# Altium project PowerLatch.PrjPcb
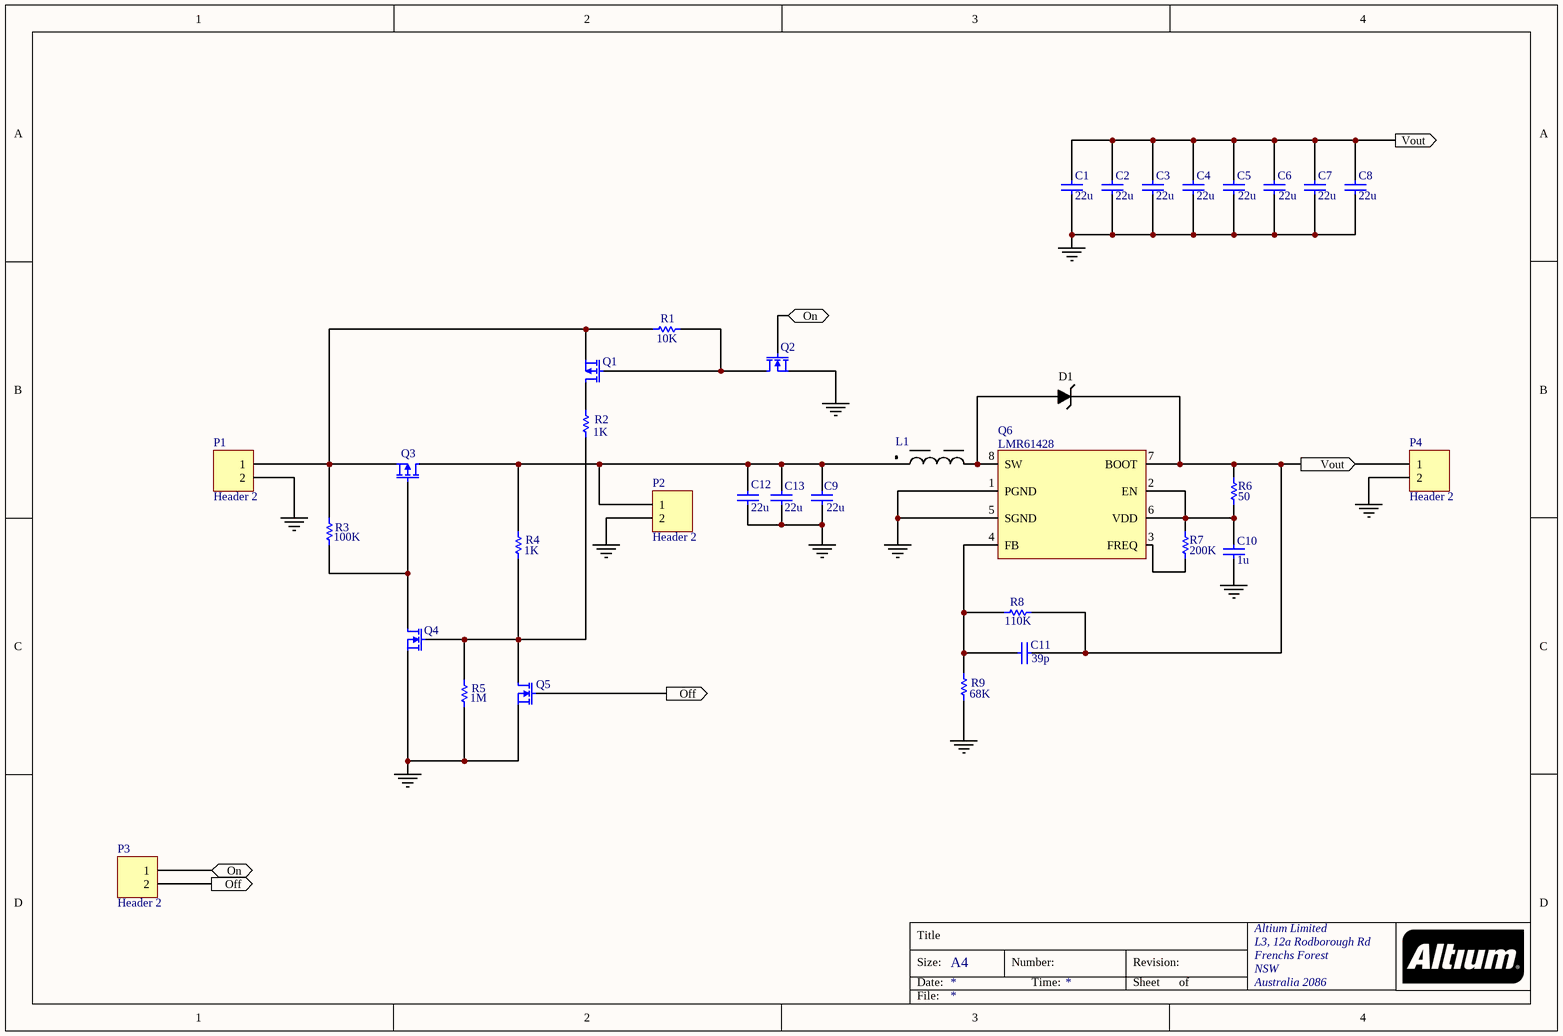
[diagram p0: PowerLatch.SchDoc]
1 sheet, 34 parts. Net scope: flat (ports and power ports of the same name join across sheets).
Board file: PowerLatch.PcbDoc

## Sheet PowerLatch.SchDoc
size A4; Organization: Altium Limited; Address1: L3, 12a Rodborough Rd; Address2: Frenchs Forest; Address3: NSW; Address4: Australia 2086

### Parts
C1  value 22u  [CAPC3225X28N]  (hidden comment: Cap)
C2  value 22u  [CAPC3225X28N]  (hidden comment: Cap)
C3  value 22u  [CAPC3225X28N]  (hidden comment: Cap)
C4  value 22u  [CAPC3225X28N]  (hidden comment: Cap)
C5  value 22u  [CAPC3225X28N]  (hidden comment: Cap)
C6  value 22u  [CAPC3225X28N]  (hidden comment: Cap)
C7  value 22u  [CAPC3225X28N]  (hidden comment: Cap)
C8  value 22u  [CAPC3225X28N]  (hidden comment: Cap)
C9  value 22u  [C1210_M]  (hidden comment: Cap)
C10  value 1u  [C1210_M]  (hidden comment: Cap)
C11  value 39p  [C1210_M]  (hidden comment: Cap)
C12  value 22u  [C1210_M]  (hidden comment: Cap)
C13  value 22u  [C1210_M]  (hidden comment: Cap)
D1  Schottky  [DIOM4336X25N]  (value not drawn)
L1  Inductor  [INDP120120X100N]  (value not drawn)
P1  Header 2  [HDR1X2]
P2  Header 2  [HDR1X2]
P3  Header 2  [HDR1X2]
P4  Header 2  [HDR1X2]
Q1  MOSFET P-Channel  [SOT95P245X110-3N]  (value not drawn)
Q2  MOSFET N-Channel  [SOT95P245X110-3N]  (value not drawn)
Q3  MOSFET P-Channel  [SOT95P245X110-3N]  (value not drawn)
Q4  MOSFET N-Channel  [SOT95P245X110-3N]  (value not drawn)
Q5  MOSFET N-Channel  [SOT95P245X110-3N]  (value not drawn)
Q6  LMR61428  [TSOP65P490X110-8N]
R1  value 10K  [RESC1608X06N]  (hidden comment: Res1)
R2  value 1K  [RESC1608X06N]  (hidden comment: Res1)
R3  value 100K  [RESC1608X06N]  (hidden comment: Res1)
R4  value 1K  [RESC1608X06N]  (hidden comment: Res1)
R5  value 1M  [RESC1608X06N]  (hidden comment: Res1)
R6  value 50  [RESC1608X06N]  (hidden comment: Res1)
R7  value 200K  [RESC1608X06N]  (hidden comment: Res1)
R8  value 110K  [RESC1608X06N]  (hidden comment: Res1)
R9  value 68K  [RESC1608X06N]  (hidden comment: Res1)

### Ports
Off (out), On (bidir), Vout (out)

### Nets
GND: C1.1 C2.1 C3.1 C4.1 C5.1 C6.1 C7.1 C8.1 C9.2 C10.1 C12.2 C13.2 P1.2 P2.2 P4.2 Q2.2(S) Q4.2(S) Q5.2(S) Q6.1(PGND) Q6.5(SGND) R5.1 R9.2
NetC1_2: C1.2 C2.2 C3.2 C4.2 C5.2 C6.2 C7.2 C8.2 C11.1 D1.2(K) P4.1 Q6.7(BOOT) R6.1 R8.2 ; port Vout
NetC9_1: C9.1 C12.1 C13.1 L1.1 P2.1 Q3.3(D) R4.2
NetC10_2: C10.2 Q6.2(EN) Q6.6(VDD) R6.2 R7.1
NetC11_2: C11.2 Q6.4(FB) R8.1 R9.1
NetD1_1: D1.1(A) L1.2 Q6.8(SW)
NetP1_1: P1.1 Q1.2(S) Q3.2(S) R1.2 R3.2
NetP3_1: P3.1 Q2.1(G) ; port On
NetP3_2: P3.2 Q5.1(G) ; port Off
NetQ1_1: Q1.1(G) Q2.3(D) R1.1
NetQ1_3: Q1.3(D) R2.2
NetQ3_1: Q3.1(G) Q4.3(D) R3.1
NetQ4_1: Q4.1(G) Q5.3(D) R2.1 R4.1 R5.2
NetQ6_3: Q6.3(FREQ) R7.2

### Notes on the sheet
- Title
- Size:
- Date:
- A4
- Number:
- Time:
- Revision:
- Sheet
- of
- File:

### Library data of the parts
C1-C13 = Cap: Capacitor; Published: 8-Jun-2000; LatestRevisionDate: 17-Jul-2002; LatestRevisionNote: Re-released for DXP Platform.; PackageReference: RAD-0.3; Publisher: Altium Limited; PackageDescription: Radial Cap, Thru-Hole; 2 Leads; 0.3 in Pin Spacing
P1-P4 = Header 2: Header, 2-Pin; LatestRevisionDate: 17-Jul-2002; LatestRevisionNote: Re-released for DXP Platform.; Publisher: Altium Limited
Q6 = LMR61428: Step-Up Voltage Regulator
R1-R9 = Res1: Resistor; Published: 8-Jun-2000; LatestRevisionDate: 17-Jul-2002; LatestRevisionNote: Re-released for DXP Platform.; PackageReference: AXIAL-0.3; Publisher: Altium Limited; PackageDescription: Axial Device, Thru-Hole; 2 Leads; 0.3 in Pin Spacing